# EAGLE design LiPolyRGB (EAGLE 6.5.0)
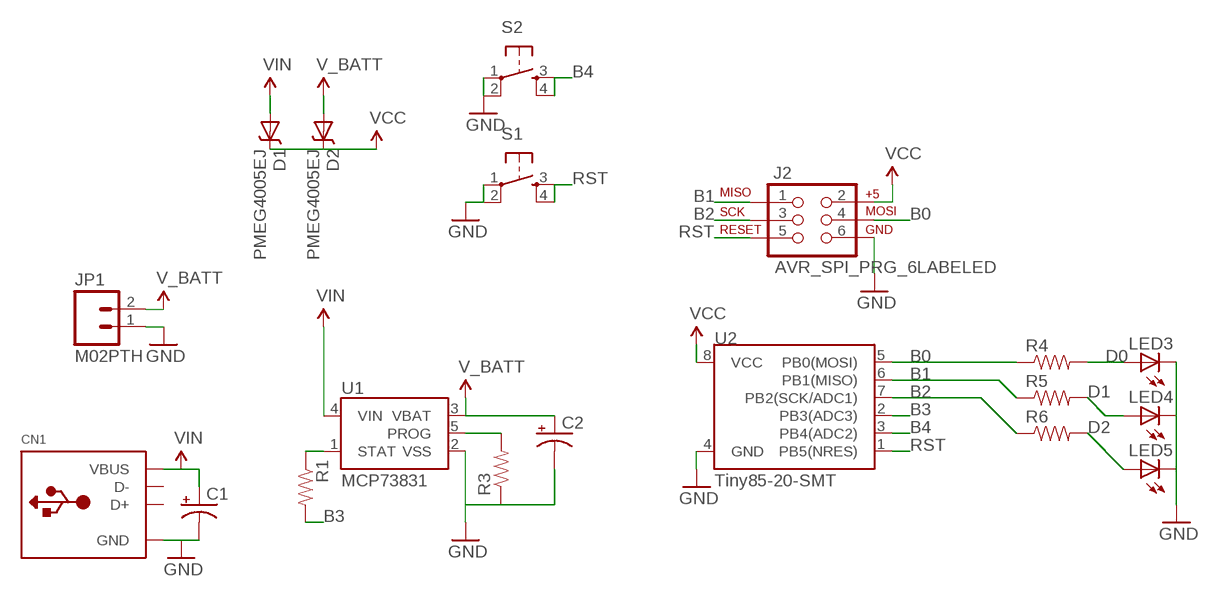
[diagram p0: schematic, sheet 1]

## Parts
C1  CAP_POL1206  [EIA3216]
C2  CAP_POL1206  [EIA3216]
CN1  USB_TYPEAPCB  [USBA_PCB]
D1  PMEG4005EJ  DIODE-SCHOTTKY-PMEG4005EJ  [SOD-323]
D2  PMEG4005EJ  DIODE-SCHOTTKY-PMEG4005EJ  [SOD-323]
J2  AVR_SPI_PRG_6LABELED  [2X3-NS]
JP1  M02PTH  [1X02]
LED3  LEDOVAL_EDGE  [LED-OVAL-EDGE]
LED4  LEDOVAL_EDGE  [LED-OVAL-EDGE]
LED5  LEDOVAL_EDGE  [LED-OVAL-EDGE]
R1  RESISTOR0805-RES  [0805]
R3  RESISTOR0805-RES  [0805]
R4  RESISTOR0805-RES  [0805]
R5  RESISTOR0805-RES  [0805]
R6  RESISTOR0805-RES  [0805]
S1  TAC_SWITCHSMD  [TACTILE-SWITCH-SMD]
S2  TAC_SWITCHSMD  [TACTILE-SWITCH-SMD]
U1  MCP73831  [SOT23-5]
U2  Tiny85-20-SMT  ATTINY45TINY85-20-SMT  [SO08-EIAJ]

## Nets
B0: J2.4 R4.1 U2.5(PB0(MOSI))
B1: J2.1 R5.1 U2.6(PB1(MISO))
B2: J2.3 R6.1 U2.7(PB2(SCK/ADC1))
B3: R1.2 U2.2(PB3(ADC3))
B4: S2.3 S2.4 U2.3(PB4(ADC2))
D0: LED3.ANODE(A) R4.2
D1: LED4.ANODE(A) R5.2
D2: LED5.ANODE(A) R6.2
GND: C1.C(-) C2.C(-) CN1.GND J2.6 JP1.1 LED3.CATHODE(C) LED4.CATHODE(C) LED5.CATHODE(C) R3.1 S1.1 S1.2 S2.1 S2.2 U1.2(VSS) U2.4(GND)
N$2: R3.2 U1.5(PROG)
RST: J2.5 S1.3 S1.4 U2.1(PB5(NRES))
STAT: R1.1 U1.1(STAT)
V_BATT: C2.A(+) D2.A JP1.2 U1.3(VBAT)
VCC: D1.C D2.C J2.2 U2.8(VCC)
VIN: C1.A(+) CN1.VCC(VBUS) D1.A U1.4(VIN)
Unconnected: CN1.USB_NEG(D-) CN1.USB_PLUS(D+)

## Library data of the parts
C1 C2 = barbary_enterprises:CAP_POL: Capacitor Polarized These are standard SMD and PTH capacitors. Normally 10uF, 47uF, and 100uF in electrolytic and tantalum varieties. Always verify the external diameter of the through hole cap, it varies with capacity, voltage, and manufacturer. The EIA devices should be standard.
CN1 = barbary_enterprises:USB_TYPEA: USB - Type A Connectors Male types stick out and are inserted into a PC or matching females parts (these are the connectors used on USB Memory Sticks, etc.). Female parts are generally used for USB Host and accept a male-type connector. SMT Male - 4UCON: 10017 PTH Female - Digikey: 609-1045-ND, 4UCon: 05241
D1 D2 = SparkFun-DiscreteSemi:DIODE-SCHOTTKY: Schottky diodes in SFE's production catalog BAT20J 1A 23V 0.62Vf RB751 120mA 40V 0.37Vf PMEG4005EJ 0.5A 40V 0.42Vf MBRA140 1A 40V 0.5Vf B340A 3A 40V SMA; PROD_ID: DIO-10955
J2 = barbary_enterprises:AVR_SPI_PRG_6: AVR ISP 6 Pin This is the reduced ISP connector for AVR programming. Common on Arduino. This footprint will take up less PCB space and can be used with a 10-pin to 6-pin adapter such as SKU: BOB-08508
JP1 = SparkFun-Connectors:M02: Standard 2-pin 0.1" header. Use with - straight break away headers ( PRT-00116) - right angle break away headers (PRT-00553) - swiss pins (PRT-00743) - machine pins (PRT-00117) - female headers (PRT-00115) Molex polarized connector foot print use with: PRT-08233 with associated crimp pins and housings. 2.54_SCREWTERM for use with PRT-10571. 3.5mm Screw Terminal footprints for PRT-08084 5mm Screw Terminal footprints for use with PRT-08433
LED3-LED5 = barbary_enterprises:LED: LEDs Standard schematic elements and footprints for 5mm, 3mm, 1206, and 0603 sized LEDs. 5mm - Spark Fun Electronics SKU : COM-00529 (and others)
R1 R3-R6 = barbary_enterprises:RESISTOR: Resistor Basic schematic elements and footprints for 0603, 1206, and PTH resistors.
S1 S2 = barbary_enterprises:TAC_SWITCH: Momentary Switch Button commonly used for reset or general input. Spark Fun Electronics SKU : COM-00097 SMT- SWCH-08247
U1 = SparkFun-PowerIC:MCP73831: Miniature single cell, fully integrated Li-Ion, Li-polymer charge management controller http://ww1.microchip.com/downloads/en/DeviceDoc/21984a.pdf IC-09995; PROD_ID: IC-09995
U2 = SparkFun-DigitalIC:ATTINY45: Atmel 8-pin 2/4/8kB flash uC; PROD_ID: IC-09092

## Board
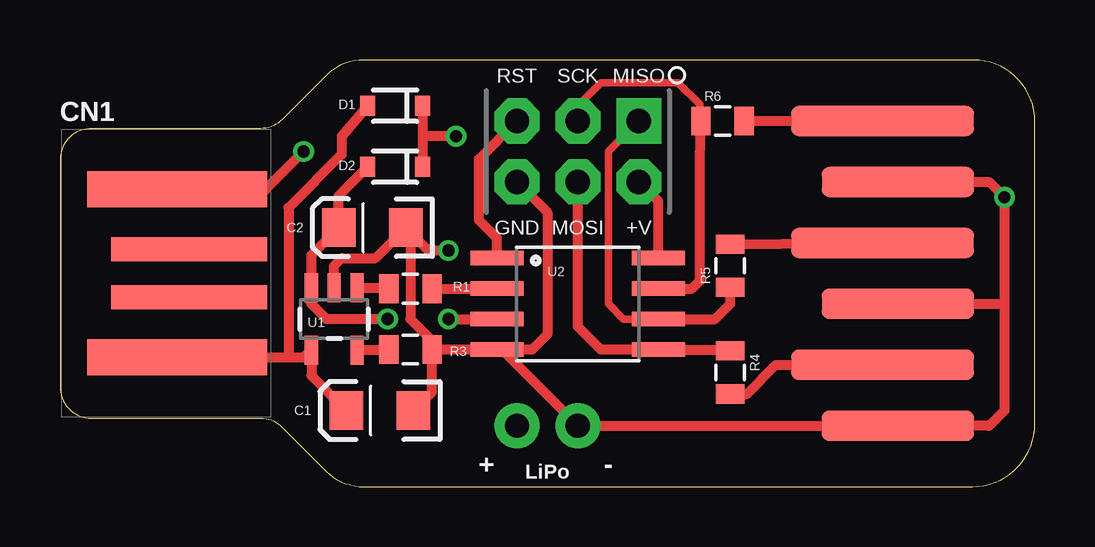
[diagram p1: board, top side]
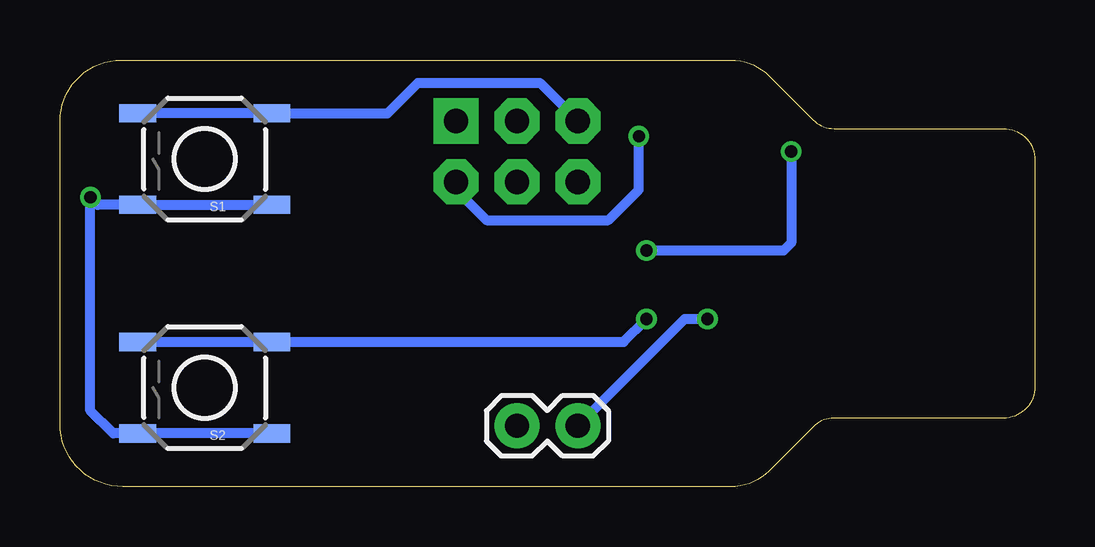
[diagram p2: board, bottom side, seen from below]

Size 40.64 x 17.78 mm. Coordinates in mm from the lower left corner, seen from the top.
Outline: 0,13.61 0,4.17 arc90 1.31,2.86 8.36,2.86 arc-45 9.26,2.49 11.1,0.65 arc45 12.67,0 38.02,0 arc90 40.64,2.62 40.64,15.22 arc90 38.08,17.78 12.67,17.78 arc45 11.1,17.13 9.26,15.29 arc-45 8.36,14.92 1.31,14.92 arc90 0,13.61
Copper layers (1*16): Top 0.0356mm / dielectric 1.5011mm / Bottom 0.0356mm
Design rules "LaenPCBOrder": minimum track width 6mil, minimum drill 13mil, track to track 6mil, track to pad 6mil, pad to pad 6mil, via to via 6mil, smd to smd 6mil, copper to edge 15mil, drill to drill 6mil, minimum pad ring 7mil, minimum via ring 7mil, stop-mask expansion 3mil, vias tented up to drill 0mil, thermal gap 10mil

### Footprints (pad centres in the part's own frame; a part is rotated, then mirrored left to right if it is on the bottom)
EIA3216 = smd 1.4 x 1.6: A 1.4,0; C -1.4,0
USBA_PCB = smd 7.5 x 1.5: GND -0.2,3.5; VCC -0.2,-3.5 | smd 6.5 x 1: USB_NEG 0.3,-1; USB_PLUS 0.3,1
SOD-323 = smd 0.63 x 0.83: A 1.15,0; C -1.15,0
2X3-NS = drill 1.016 pad 1.88 square: 1 -2.54,-1.27 | drill 1.016 pad 1.88 octagon: 2 -2.54,1.27; 3 0,-1.27; 4 0,1.27; 5 2.54,-1.27; 6 2.54,1.27
1X02 = drill 1.016 pad 1.88: 1 0,0; 2 2.54,0
LED-OVAL-EDGE = smd 7.62 x 1.27: ANODE -1.905,1.27 | smd 6.35 x 1.27: CATHODE -1.27,-1.27
0805 = smd 0.8 x 1.2: 1 -0.9,0; 2 0.9,0
TACTILE-SWITCH-SMD = smd 1.524 x 0.762: 1 -2.794,1.905; 2 2.794,1.905; 3 -2.794,-1.905; 4 2.794,-1.905
SOT23-5 = smd 0.55 x 1.2: 1 -0.95,-1.3; 2 0,-1.3; 3 0.95,-1.3; 4 0.95,1.3; 5 -0.95,1.3
SO08-EIAJ = smd 0.61 x 2.21: 1 -1.905,-3.378; 2 -0.635,-3.378; 3 0.635,-3.378; 4 1.905,-3.378; 5 1.905,3.353; 6 0.635,3.353; 7 -0.635,3.353; 8 -1.905,3.353

### Placement (x,y rotation side)
C1  13.34,3.17 180 top
C2  13.02,10.79 180 top
CN1  5.08,8.89 0 top
D1  13.97,15.88 180 top
D2  13.97,13.34 180 top
J2  21.59,13.97 180 top
JP1  21.59,2.54 0 bottom
LED3  36.2,3.81 0 top
LED4  36.2,8.89 0 top
LED5  36.2,13.97 0 top
R1  14.61,8.26 0 top
R3  14.61,5.71 180 top
R4  27.94,4.76 270 top
R5  27.94,9.21 90 top
R6  27.62,15.24 0 top
S1  34.61,13.65 180 bottom
S2  34.61,4.13 180 bottom
U1  11.43,6.99 180 top
U2  21.59,7.62 270 top

### Tracks (layer width: path | path; a pad name or v marks a point on that pad's centre or on a via)
B0
  Top 0.406: J2.4 21.59,6.67 22.54,5.71 U2.5 27.68,5.71 R4.1
B1
  Top 0.305: J2.1 22.86,13.97 22.86,7.62 23.5,6.99 U2.6
  Top 0.406: U2.6 27.3,6.99 27.94,7.62 R5.1
B2
  Top 0.305: J2.3 21.59,15.88 22.54,16.83 25.77,16.83 26.67,15.93 26.67,15.24 R6.1
  Top 0.406: U2.7 26.35,8.26 26.67,8.57 26.67,13.6 R6.1
B3
  Top 0.406: R1.2 U2.2
B4  (via drill 0.51)
  Top 0.406: v16.19,6.99 U2.3
  Bottom 0.406: S2.4 S2.3 17.14,6.03 v16.19,6.99
D0
  Top 0.406: R4.2 28.63,3.86 29.84,5.08 LED3.ANODE
D1
  Top 0.406: R5.2 LED4.ANODE
D2
  Top 0.406: R6.2 LED5.ANODE
GND  (via drill 0.51)
  Top 0.406: C1.C 15.51,3.94 R3.1 | C2.C 14.61,10.61 14.61,6.99 15.51,6.08 R3.1 | U1.2 11.43,9.21 11.75,9.53 13.15,9.53 C2.C | CN1.GND 8.58,12.39 v10.16,13.97 | v16.19,9.84 15.37,9.84 C2.C | R3.1 U2.4 18.41,5.71 18.73,5.4 | 18.73,5.4 JP1.1 LED3.CATHODE 38.73,2.54 39.37,3.17 39.37,7.62 | LED5.CATHODE 38.73,12.7 v39.37,12.06 39.37,7.62 | LED4.CATHODE 39.37,7.62 | J2.6 20.32,11.43 20.32,6.35 19.68,5.71 19.05,5.71 18.73,5.4
  Bottom 0.406: v10.16,13.97 10.16,10.16 10.48,9.84 v16.19,9.84 | S1.1 S1.2 39.05,11.75 v39.37,12.06 39.37,3.17 38.42,2.22 S2.2 S2.1
N$2
  Top 0.406: R3.2 13.68,5.68 U1.5
RST
  Top 0.406: U2.1 18.21,10.36 17.46,11.11 17.46,13.65 J2.5
  Bottom 0.406: S1.4 S1.3 26.99,15.56 25.72,16.83 20.64,16.83 J2.5
STAT
  Top 0.406: U1.1 13.68,8.29 R1.1
V_BATT  (via drill 0.51)
  Top 0.406: D2.A 11.62,12.13 C2.A 10.48,9.66 U1.3 10.48,7.62 11.11,6.99 v13.65,6.99
  Bottom 0.406: v13.65,6.99 14.61,6.99 JP1.2
VCC  (via drill 0.51)
  Top 0.406: D1.C 15.12,14.61 | 15.12,14.61 D2.C | U2.8 24.94,11.89 J2.2 | v16.51,14.61 15.12,14.61
  Bottom 0.406: J2.2 24.13,12.38 22.86,11.11 17.78,11.11 16.51,12.38 v16.51,14.61
VIN
  Top 0.406: CN1.VCC 9.53,5.39 | 9.53,5.39 10.19,5.39 U1.4 10.48,4.63 C1.A | D1.A 11.75,14.61 11.75,13.85 9.53,11.63 9.53,5.39

### Text on the board
tPlace: + | LiPo | -